# EAGLE design IV PSU (EAGLE 5.07)
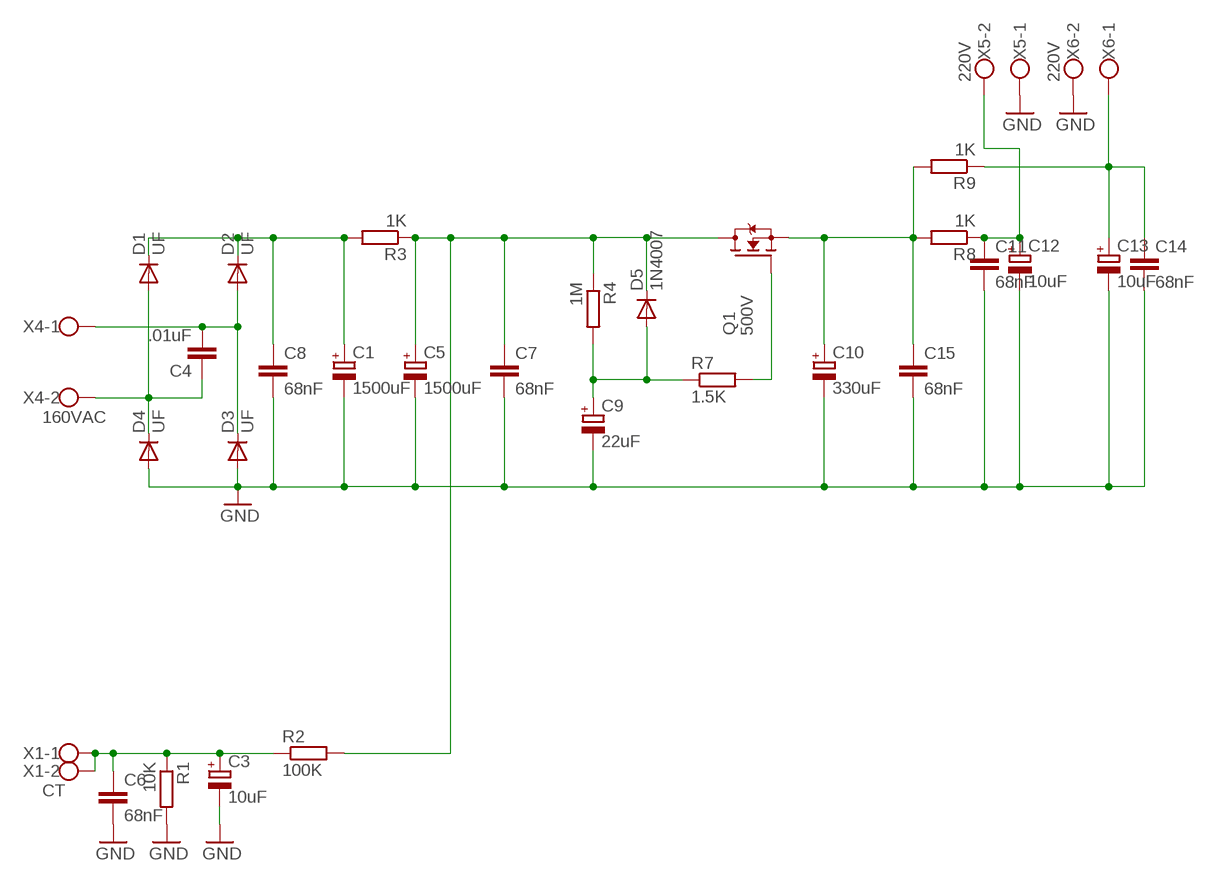
[diagram p0: schematic, sheet 1]

## Parts
C1  1500uF  CPOL-EUE10-35  [EB35D]
C3  10uF  CPOL-EUE10-20  [EB20D]
C4  .01uF  C-EU102-043X133  [C102-043X133]
C5  1500uF  CPOL-EUE10-35  [EB35D]
C6  68nF  C-EU102-043X133  [C102-043X133]
C7  68nF  C-EU102-043X133  [C102-043X133]
C8  68nF  C-EU102-043X133  [C102-043X133]
C9  22uF  CPOL-EUE10-20  [EB20D]
C10  330uF  CPOL-EUE10-35  [EB35D]
C11  68nF  C-EU102-043X133  [C102-043X133]
C12  10uF  CPOL-EUE10-20  [EB20D]
C13  10uF  CPOL-EUE10-20  [EB20D]
C14  68nF  C-EU102-043X133  [C102-043X133]
C15  68nF  C-EU102-043X133  [C102-043X133]
D1  UF  BYT08P  [TO220ACS]
D2  UF  BYT08P  [TO220ACS]
D3  UF  BYT08P  [TO220ACS]
D4  UF  BYT08P  [TO220ACS]
D5  1N4007  1N4004  [DO41-10]
Q1  500V  SPW47N60S5  [P-TO247]
R1  10K  R-EU_0309/12  [0309/12]
R2  100K  R-EU_0309/12  [0309/12]
R3  1K  R-EU_0617/22  [0617/22]
R4  1M  R-EU_0309/12  [0309/12]
R7  1.5K  R-EU_0309/12  [0309/12]
R8  1K  R-EU_0617/22  [0617/22]
R9  1K  R-EU_0617/22  [0617/22]
X1  CT  W237-02P  [W237-132]
X4  160VAC  W237-02P  [W237-132]
X5  220V  W237-02P  [W237-132]
X6  220V  W237-02P  [W237-132]

## Nets
GND: C1.- C3.- C5.- C6.2 C7.2 C8.2 C9.- C10.- C11.2 C12.- C13.- C14.2 C15.2 D3.A D4.A R1.2 X5.1 X6.2
N$5: C3.+ C6.1 R1.1 R2.1 X1.1 X1.2
N$7: C5.+ C7.1 D5.C Q1.2(D) R2.2 R3.1 R4.1
N$9: C4.1 D1.A D4.C X4.2
N$10: C4.2 D2.A D3.C X4.1
N$12: C1.+ C8.1 D1.C D2.C R3.2
N$16: C9.+ D5.A R4.2 R7.1
N$17: Q1.1(G) R7.2
N$18: C10.+ C15.1 Q1.3(S) R8.2 R9.2
N$21: C11.1 C12.+ R8.1 X5.2
N$22: C13.+ C14.1 R9.1 X6.1

## Library data of the parts
C1 C3 C5 C9 C10 C12 C13 = resistor:CPOL-EU: POLARIZED CAPACITOR, European symbol
C4 C6-C8 C11 C14 C15 = resistor:C-EU: CAPACITOR, European symbol
D1-D4 = diode:BYT08P: DIODE ultra fast
D5 = diode:1N4004: DIODE general purpose rectifier, 1 A
Q1 = transistor-fet:SPW47N60S5: Cool MOS Power Transistor
R1-R4 R7-R9 = resistor:R-EU_: RESISTOR, European symbol
X1 X4-X6 = con-wago-508:W237-02P: WAGO SREW CLAMP

## Board
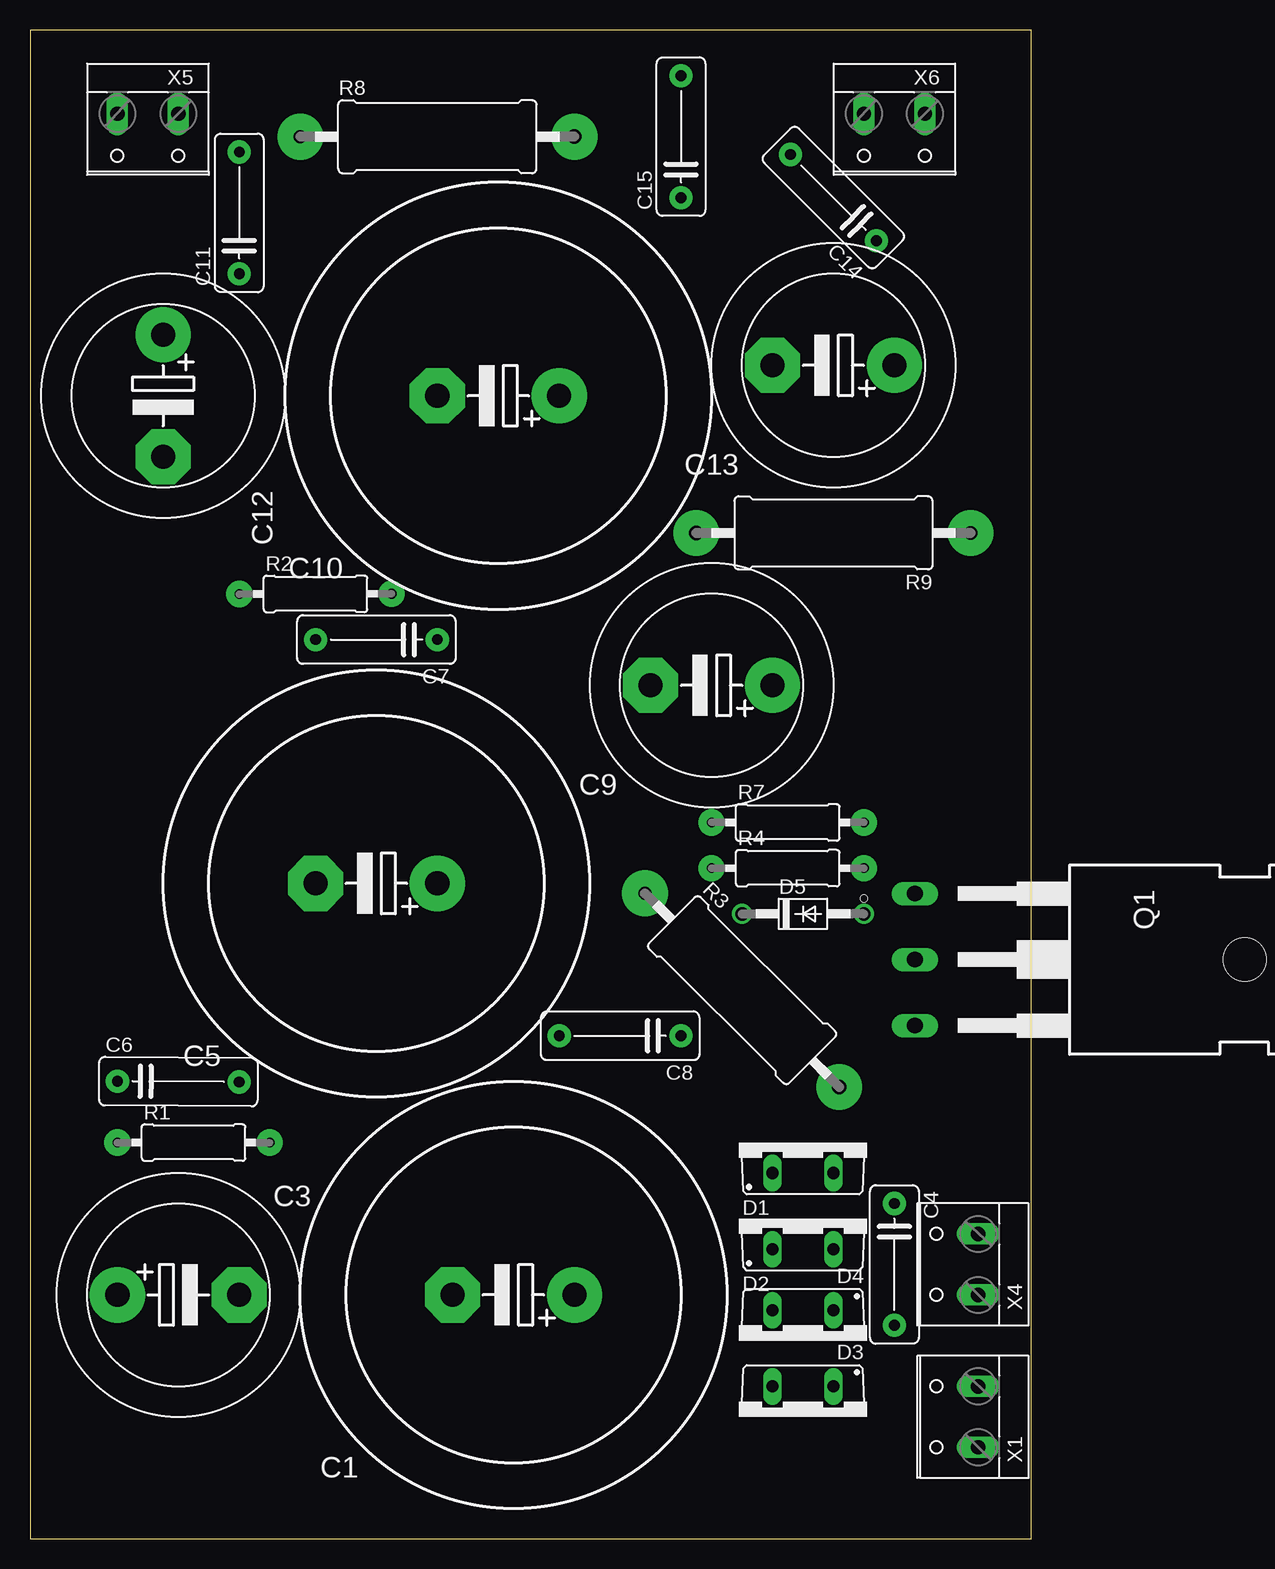
[diagram p1: board, top side]
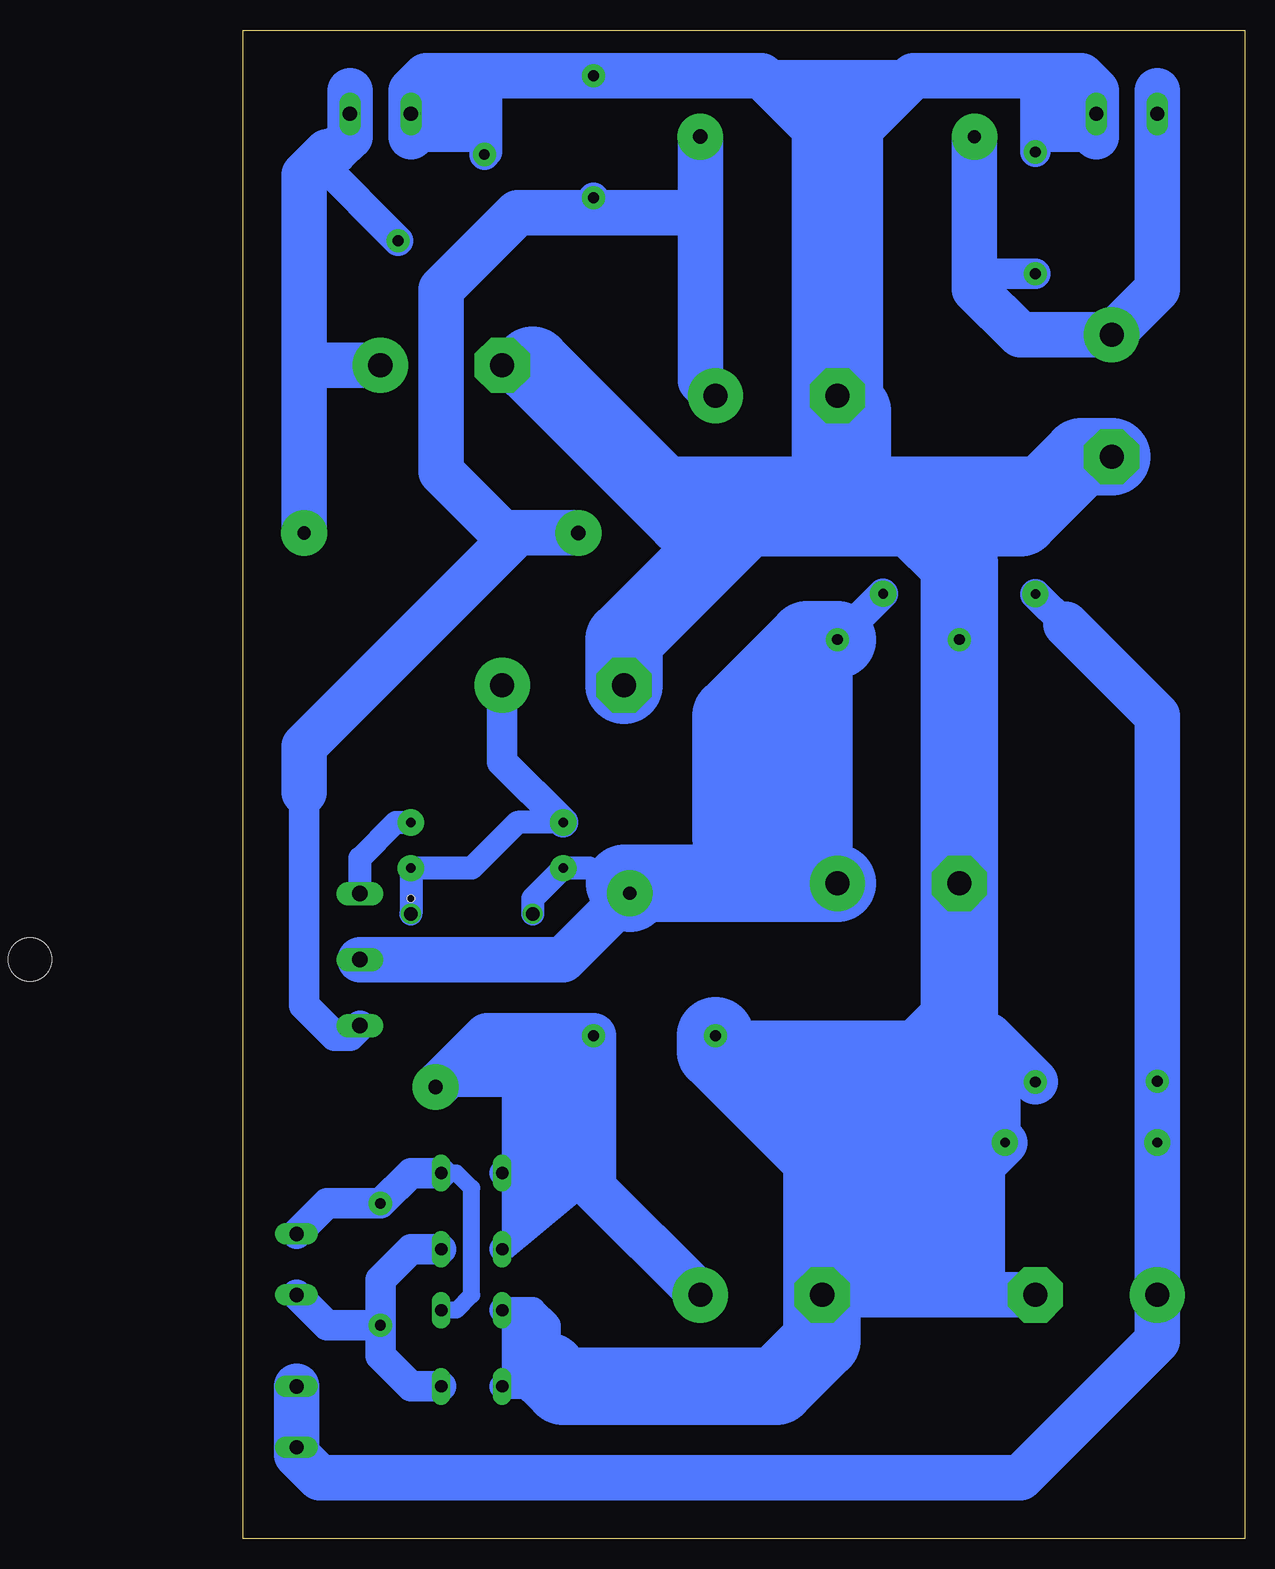
[diagram p2: board, bottom side, seen from below]

Size 83.49 x 125.71 mm. Coordinates in mm from the lower left corner, seen from the top.
Outline: 83.49,0 83.49,125.71 0,125.71 0,0 83.49,0
Copper layers (1*16): Top 0.035mm / dielectric 1.5mm / Bottom 0.035mm
Design rules "default *": minimum track width 10mil, minimum drill 30mil, track to track 8mil, track to pad 8mil, pad to pad 8mil, via to via 8mil, smd to smd 8mil, copper to edge 40mil, drill to drill 8mil, minimum pad ring 10mil, minimum via ring 8mil, stop-mask expansion 4mil, vias tented up to drill 0mil, thermal gap 10mil
Holes 0.6 mm at 69.52,-58.42 69.52,53.34 282.88,53.34

### Footprints (pad centres in the part's own frame; a part is rotated, then mirrored left to right if it is on the bottom)
EB35D = drill 2.007 pad 4.597 round: + -5.08,0 | drill 2.007 pad 4.597 octagon: - 5.08,0
EB20D = drill 2.007 pad 4.597 round: + -5.08,0 | drill 2.007 pad 4.597 octagon: - 5.08,0
C102-043X133 = drill 0.9 pad 1.93 round: 1 -5.08,0; 2 5.08,0
TO220ACS = drill 1.016 long: A 2.54,-2.54; C -2.54,-2.54
DO41-10 = drill 1.118 round: A 5.08,0; C -5.08,0
P-TO247 = drill 1.3 long: 1 -5.5,-27.5; 2 0,-27.5; 3 5.5,-27.5 | hole 3.6: 0,0
0309/12 = drill 0.8 pad 2.184 round: 1 -6.35,0; 2 6.35,0
0617/22 = drill 1.1 pad 3.81 round: 1 -11.43,0 | drill 1.2 pad 3.81 round: 2 11.43,0
W237-132 = drill 1.194 long: 1 -2.54,-0.635; 2 2.54,-0.635

### Placement (x,y rotation side)
C1  40.31,20.32 180 top
C3  12.37,20.32 0 top
C4  72.06,22.86 270 top
C5  28.88,54.61 180 top
C6  12.37,38.1 359.6 top
C7  28.88,74.93 180 top
C8  49.2,41.91 180 top
C9  56.82,71.12 180 top
C10  39.04,95.25 180 top
C11  17.45,110.49 90 top
C12  11.1,95.25 270 top
C13  66.98,97.79 180 top
C14  66.98,111.76 135 top
C15  54.28,116.84 90 top
D1  64.44,33.02 0 top
D2  64.44,26.67 0 top
D3  64.44,10.16 180 top
D4  64.44,16.51 180 top
D5  64.44,52.07 0 top
Q1  101.27,48.26 270 top
R1  13.64,33.02 0 top
R2  23.8,78.74 0.1 top
R3  59.36,45.72 315.1 top
R4  63.17,55.88 0 top
R7  63.17,59.69 0 top
R8  33.96,116.84 0 top
R9  66.98,83.82 180 top
X1  78.41,10.16 90 top
X4  78.41,22.86 90 top
X5  9.83,118.11 180 top
X6  72.06,118.11 180 top

### Tracks (layer width: path | path; a pad name or v marks a point on that pad's centre or on a via)
GND
  Bottom 2.184: D4.A 59.36,19.05 58.09,17.78 58.09,13.97 59.36,12.7 D3.A
  Bottom 2.54: 17.45,121.92 C11.2 | C14.2 63.17,115.57 63.17,121.92
  Bottom 3.81: 12.37,116.84 X5.1 12.37,120.65 13.64,121.92 17.45,121.92 27.61,121.92 33.96,115.57 40.31,121.92 C15.2 63.17,121.92 68.25,121.92 69.52,120.65 X6.2 69.52,116.84 | 59.36,97.79 C13.- | C6.2 21.3,41.91 22.53,41.91 23.8,43.18 | R1.2 22.53,30.48 35.23,30.48 | C3.- C1.-
  Bottom 6.452: 27.61,85.09 23.8,81.28 C7.2 C5.- 23.8,43.18 35.23,31.75 | 27.61,85.09 32.69,85.09 | 32.69,85.09 41.58,85.09 | 41.58,85.09 51.74,74.93 C9.- | 32.69,85.09 32.69,93.98 C10.- 33.96,115.57 | 41.58,85.09 46.66,85.09 59.36,97.79 | C12.- 13.64,90.17 18.72,85.09 27.61,85.09 | 35.23,31.75 35.23,30.48 C1.- 35.23,16.51 39.04,12.7 56.82,12.7 58.09,13.97 | C8.2 44.12,40.64 35.23,31.75
N$5
  Bottom 2.54: R2.1 14.92,76.2 14.91,76.2
  Bottom 3.81: 14.91,76.2 7.29,68.58 C6.1 7.29,25.4 R1.1 C3.+ 7.29,16.51 18.72,5.08 77.14,5.08 79.05,6.98 X1.1 X1.2
N$7
  Bottom 1.93: R3.1 54.63,55.88 R4.1 59.36,53.34 D5.C
  Bottom 2.54: R2.2 C7.1
  Bottom 3.81: Q1.2 56.82,48.26 51.74,53.34 53.01,54.61 44.12,54.61
  Bottom 6.452: C5.+ 39.04,54.61 | 39.04,54.61 42.85,58.42 42.85,68.58 36.5,74.93 C7.1 | 39.04,54.61 44.12,54.61 51.71,54.61 R3.1
N$9
  Bottom 1.422: D4.C 65.71,19.05 64.44,20.32 64.44,29.21 65.71,30.48 D1.A
  Bottom 2.54: X4.2 76.51,27.94 C4.1 69.52,30.48 D1.A
N$10
  Bottom 2.54: X4.1 76.51,17.78 C4.2 | D3.C 69.52,12.7 72.06,15.24 C4.2 | C4.2 72.06,21.59 69.52,24.13 D2.A
N$12
  Bottom 2.184: D1.C 54.28,30.48 D2.C
  Bottom 3.81: R3.2 67.43,37.65 63.17,41.91 C8.1 54.28,30.48 54.28,29.21 C1.+
N$16
  Bottom 1.93: D5.A R4.2 64.44,55.88 60.63,59.69 R7.1
  Bottom 2.54: C9.+ 61.9,64.77 R7.1
N$17
  Bottom 1.93: R7.2 70.79,59.69 73.77,56.71 Q1.1
N$18
  Bottom 2.54: Q1.3 74.6,41.93 74.6,41.91 75.87,41.91 78.41,44.45 78.41,62.23 | 54.28,110.49 C15.1
  Bottom 3.81: 78.41,62.23 78.41,66.04 60.63,83.82 R9.2 61.9,83.82 66.98,88.9 66.98,104.14 60.63,110.49 54.28,110.49 45.39,110.49 | 45.39,110.49 R8.2 | C10.+ 45.39,96.52 45.39,110.49
N$21
  Bottom 2.54: 22.53,105.41 C11.1
  Bottom 3.81: R8.1 22.53,105.41 22.53,104.14 18.72,100.33 C12.+ 7.29,104.14 X5.2 7.29,120.65
N$22
  Bottom 2.54: C14.1 77.14,114.74 75.87,115.57
  Bottom 3.81: 78.41,97.79 C13.+ | R9.1 78.41,97.79 | 78.41,97.79 78.41,113.66 76.51,115.57 75.87,115.57 74.6,116.84 X6.1 74.6,120.65
(copper drawn outside any net)
  shapes: Bottom area x25